# Altium schematic sheet Peripherals.SchDoc: Joystick, ACP, LEDs and Push Button
size A4; Date: 01-DEC-2013; Author: A.B; CompanyName: STMicroelectronics; Organization: Microcontrollers Division; Address1: 12, Rue Jules HOROWITZ; Address2: 38019 Grenoble; Address3: FRANCE; DocumentNumber: MB1184; Revision: C-01; SheetNumber: 5; SheetTotal: 10; Project: STM32L476G-DISCO
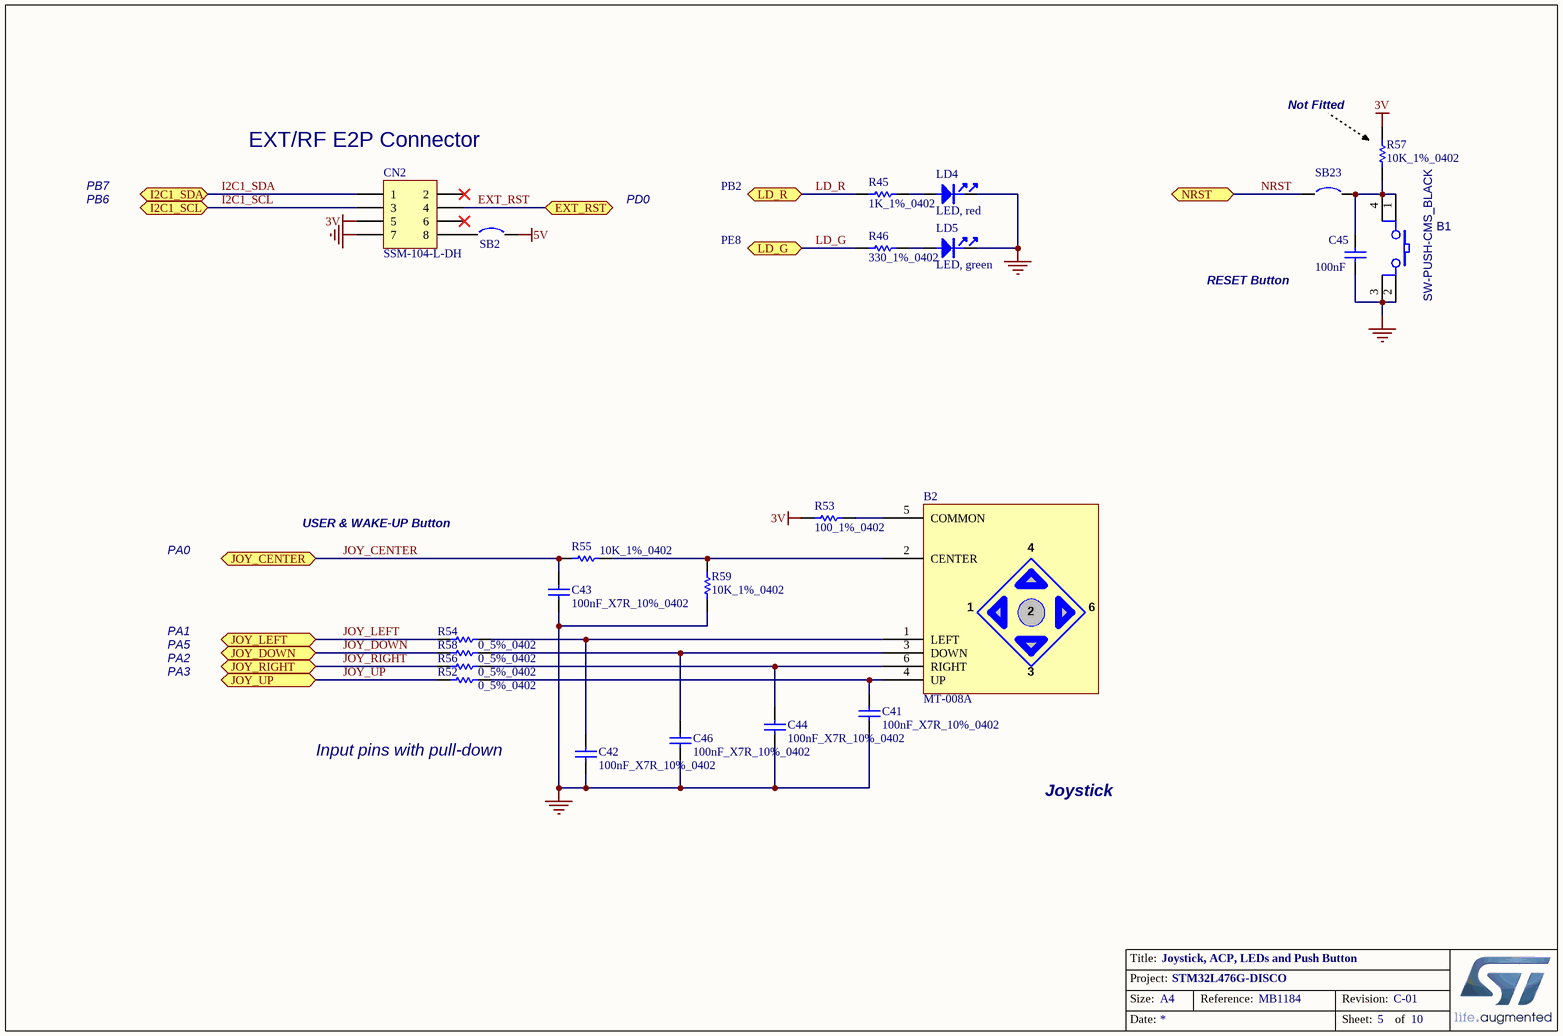
[diagram p0: Peripherals.SchDoc]

## Parts
B1  SW-PUSH-CMS_BLACK  [BP1CMS]
B2  MT-008A  [MT-008A]
C41  100nF_X7R_10%_0402  [0402C]
C42  100nF_X7R_10%_0402  [0402C]
C43  100nF_X7R_10%_0402  [0402C]
C44  100nF_X7R_10%_0402  [0402C]
C45  100nF  [0402C]
C46  100nF_X7R_10%_0402  [0402C]
CN2  SSM-104-L-DH  [SSM-104-L-DH]
LD4  LED, red  [0603D]
LD5  LED, green  [0603D]
R45  1K_1%_0402  [0402R]
R46  330_1%_0402  [0402R]
R52  0_5%_0402  [0402R]
R53  100_1%_0402  [0402R]
R54  0_5%_0402  [0402R]
R55  10K_1%_0402  [0402R]
R56  0_5%_0402  [0402R]
R57  10K_1%_0402  [0402R]
R58  0_5%_0402  [0402R]
R59  10K_1%_0402  [0402R]
SB2  Circuit Breaker  [JP2_SMD]  (value not drawn)
SB23  Circuit Breaker  [JP2_SMD]  (value not drawn)

## Ports
EXT_RST, I2C1_SCL, I2C1_SDA, JOY_CENTER, JOY_DOWN, JOY_LEFT, JOY_RIGHT, JOY_UP, LD_G, LD_R, NRST

## Nets
3V: CN2.5 R53.1 R57.2
5V: SB2.2
GND: B1.2 B1.3 C41.1 C42.1 C43.1 C44.1 C45.1 C46.1 CN2.7 LD4.2 LD5.2 R59.1
EXT_RST: CN2.4 ; port EXT_RST
I2C1_SCL: CN2.3 ; port I2C1_SCL
I2C1_SDA: CN2.1 ; port I2C1_SDA
JOY_CENTER: C43.2 R55.1 ; port JOY_CENTER
JOY_DOWN: R58.1 ; port JOY_DOWN
JOY_LEFT: R54.1 ; port JOY_LEFT
JOY_RIGHT: R56.1 ; port JOY_RIGHT
JOY_UP: R52.1 ; port JOY_UP
LD_G: R46.1 ; port LD_G
LD_R: R45.1 ; port LD_R
NRST: SB23.1 ; port NRST
NetB1_1: B1.1 B1.4 C45.2 R57.1 SB23.2
NetB2_1: B2.1(LEFT) C42.2 R54.2
NetB2_2: B2.2(CENTER) R55.2 R59.2
NetB2_3: B2.3(DOWN) C46.2 R58.2
NetB2_4: B2.4(UP) C41.2 R52.2
NetB2_5: B2.5(COMMON) R53.2
NetB2_6: B2.6(RIGHT) C44.2 R56.2
NetCN2_8: CN2.8 SB2.1
NetLD4_1: LD4.1 R45.2
NetLD5_1: LD5.1 R46.2

Not connected (* = marked no-connect by the designer): CN2 2* 6*

## Notes on the sheet
- (near R57) Not Fitted
- (near CN2) EXT/RF E2P Connector
- PB6
- PB7
- PD0
- PB2
- PE8
- RESET Button
- PA0
- USER & WAKE-UP Button
- PA1
- PA5
- PA2
- PA3
- Input pins with pull-down
- Joystick
- Title:
- Project:
- Size:
- Date:
- A4
- Reference:
- Sheet:
- Revision:
- of

## Library data of the parts
B1 = SW-PUSH-CMS_BLACK: Non-Open Push-Button 0.1A 24V; Manuf_2: FARNELL; Manuf_Part_2: 535-930; Manuf_1: wealthmetal; Manuf_Part_1: TD0341X-G01-BLA; Ref St: 9180120; Description: Non-Open Push Button,Black 0.1A 24V,Square head,6*6,SMT,180Degree,TD-0341X-GO1,wealthmetal; Distrib: JFVNY; ECCN_US/EU: n/a
B2 = MT-008A: Joystick with Hat, Multi Function Switch; Manuf_1: XIEJIA Electronics; Manuf_Part_1: MT-008A; Distrib: Jiubaba; Order: MT-008A; ECCN_US/EU: n/a
C41-C46 = Cap_100nF_X7R_10%_0402: Capacitor,100nF,16V,X7R,10%,0402,YAGEO; Manuf_Part_1: CC0402KRX7R7BB104; Revision: July-2002: Re-released for DXP Platform.; Value: 100nF; Order: CC0402KRX7R7BB104; Manuf_1: YAGEO
  C41-C44 C46: ECCN_US/EU: n/a
CN2 = SSM-104-L-DH: Header, 5-Pin, Dual row; Revision: 17-Jul-2002: Re-released for DXP Platform.; Publisher: Altium Limited
LD4 = LED_red: LED, red, 0603; Manuf_1: everlight; Manuf_Part_1: 19-213-R6C-AP1Q2B/3T; Description: LED,red,0603,19-213-R6C-AP1Q2B/3T,everlight; ECCN_US/EU: EAR99/NEC; Order: 19-213-R6C-AP1Q2B/3T
LD5 = LED_green: LED, green, 0603; Manuf_1: everlight; Manuf_Part_1: 19-213SYGC/S530-E2/TR8; Description: LED,green,0603,19-213SYGC/S530-E2/TR8,everlight; ECCN_US/EU: EAR99/NEC; Order: 19-213SYGC/S530-E2/TR8
R45 = Res_1K_1%_0402: Resistor,1K,0402,1%,YAGEO; Manuf_Part_1: RC0402FR-071KL; Value: 1K; Manuf_1: YAGEO; Order: RC0402FR-071KL; ECCN_US/EU: n/a
R46 = Res_330_1%_0402: Resistor,330,0402,1%,YAGEO; Manuf_Part_1: RC0402FR-07330RL; Value: 330; ECCN_US/EU: n/a; Manuf_1: YAGEO; Distrib: DIGIKEY; Order: RC0402FR-07330RL
R52 R54 R56 R58 = Res_0_5%_0402: Resistor,0,0402,5%,YAGEO; Manuf_Part_1: RC0402JR-070RL; Value: 0; Order: 2363467; ECCN_US/EU: n/a; Manuf_1: YAGEO; Distrib: FARNELL
R53 = Res_100_1%_0402: Resistor,100,0402,1%,YAGEO; Manuf_Part_1: RC0402FR-07100RL; Value: 100; Order: 9239111; Manuf_1: YAGEO; ECCN_US/EU: n/a; Distrib: FARNELL
R55 R59 = Res_10K_1%_0402: Resistor,10K,0402,1%,YAGEO; Manuf_Part_1: RC0402FR-0710KL; Value: 10K; Manuf_1: YAGEO; Order: RC0402FR-0710KL; ECCN_US/EU: n/a
R57 = Res_10K_1%_0402: Resistor,10K,0402,1%,YAGEO; Manuf_Part_1: RC0402FR-0710KL; Fitted: NO; Value: 10K; Manuf_1: YAGEO; Order: RC0402FR-0710KL; ECCN_US/EU: n/a
SB2 = Circuit Breaker: Solder: NO; Revision: July-2002: Re-released for DXP Platform.
SB23 = Circuit Breaker: Solder: YES; Revision: July-2002: Re-released for DXP Platform.